# EAGLE schematic ldo (EAGLE 9.6.2)
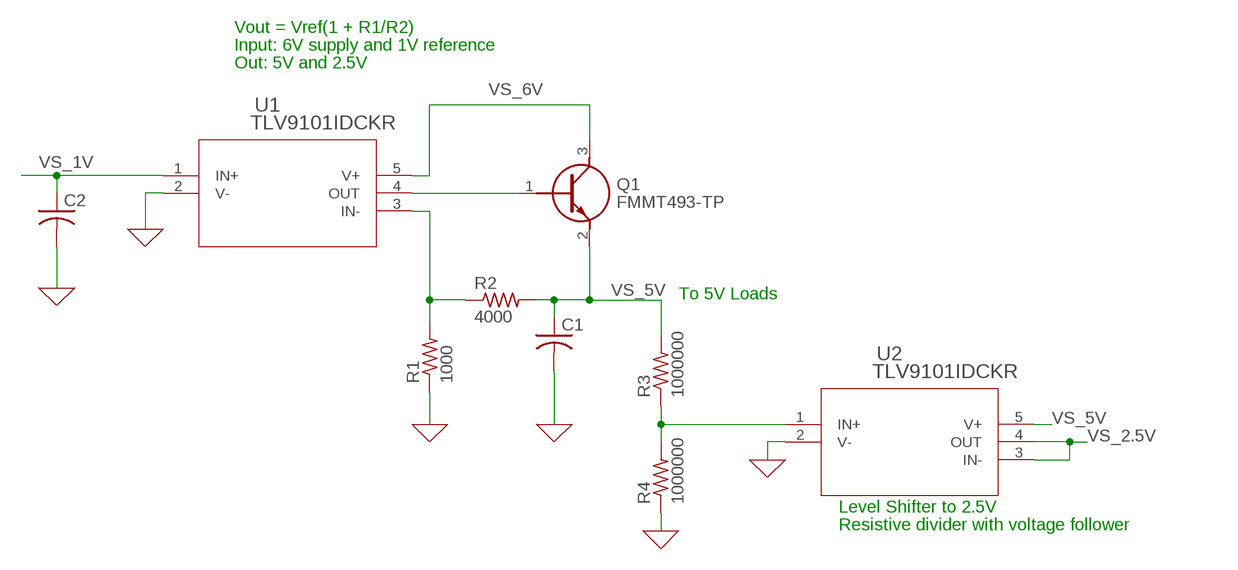
[diagram p0: schematic, sheet 1]

## Parts
C1  C-USC0603  [C0603]
C2  C-USC0603  [C0603]
Q1  FMMT493-TP  [SOT95P237X125-3N]
R1  1000  R-US_R0603  [R0603]
R2  4000  R-US_R0603  [R0603]
R3  1000000  R-US_R0603  [R0603]
R4  1000000  R-US_R0603  [R0603]
U1  TLV9101IDCKR  [SC70-5_DCK_TEX]
U2  TLV9101IDCKR  [SC70-5_DCK_TEX]

## Nets
0: C1.2 C2.2 R1.1 R4.1 U1.2(V-) U2.2(V-) ; supply symbol labelled GND
N$1: Q1.1(B) U1.4(OUT)
N$2: R1.2 R2.1 U1.3(IN-)
N$3: R3.1 R4.2 U2.1(IN+)
VS_1V: C2.1 U1.1(IN+)
VS_2.5V: U2.3(IN-) U2.4(OUT)
VS_5V: C1.1 Q1.2(E) R2.2 R3.2 U2.5(V+)
VS_6V: Q1.3(C) U1.5(V+)

## Notes on the sheet
- Vout = Vref(1 + R1/R2)
- Input: 6V supply and 1V reference
- Out: 5V and 2.5V
- To 5V Loads
- Level Shifter to 2.5V
- Resistive divider with voltage follower

## Library data of the parts
C1 C2 = rcl:C-US: CAPACITOR, American symbol; SPICEPREFIX: C
Q1 = FMMT493-TP:FMMT493-TP: Bipolar (BJT) Transistor NPN 100 V 1 A 150MHz 250 mW Surface Mount SOT-23 Source: Datasheet <https://www.mccsemi.com/pdf/Products/FMMT493(SOT-23).pdf>; DESCRIPTION: Bipolar (BJT) Transistor NPN 100 V 1 A 150MHz 250 mW Surface Mount SOT-23; HEIGHT: 1.25mm; MANUFACTURER_NAME: MCC; MANUFACTURER_PART_NUMBER: FMMT493-TP; MOUSER_PART_NUMBER: 833-FMMT493-TP; MOUSER_PRICE-STOCK: https://www.mouser.co.uk/ProductDetail/Micro-Commercial-Components-MCC/FMMT493-TP?qs=P1JMDcb91o49aIAG8wYRww%3D%3D
R1-R4 = rcl:R-US_: RESISTOR, American symbol; SPICEPREFIX: R
U1 U2 = TLV9101IDCKR:TLV9101IDCKR; COPYRIGHT: Copyright (C) 2024 Ultra Librarian. All rights reserved.; MANUFACTURER_PART_NUMBER: TLV9101IDCKR; MFR_NAME: Texas Instruments